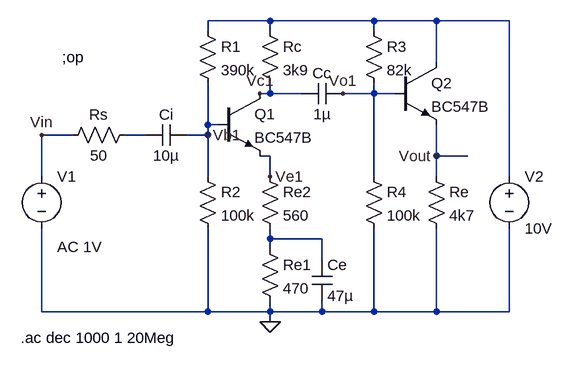
[diagram p0: schematic Combined.asc]
Combined.asc, the LTspice schematic file:
Version 4
SHEET 1 1304 680
WIRE 496 -288 400 -288
WIRE 656 -288 496 -288
WIRE 752 -288 656 -288
WIRE 864 -288 752 -288
WIRE 400 -272 400 -288
WIRE 496 -272 496 -288
WIRE 656 -272 656 -288
WIRE 752 -224 752 -288
WIRE 496 -176 496 -192
WIRE 496 -176 480 -176
WIRE 528 -176 496 -176
WIRE 544 -176 528 -176
WIRE 656 -176 656 -192
WIRE 656 -176 608 -176
WIRE 672 -176 656 -176
WIRE 688 -176 672 -176
WIRE 400 -128 400 -192
WIRE 416 -128 400 -128
WIRE 192 -112 144 -112
WIRE 304 -112 272 -112
WIRE 400 -112 400 -128
WIRE 400 -112 368 -112
WIRE 496 -80 480 -80
WIRE 752 -80 752 -128
WIRE 784 -80 752 -80
WIRE 800 -80 784 -80
WIRE 144 -48 144 -112
WIRE 400 -48 400 -112
WIRE 496 -48 496 -80
WIRE 656 -48 656 -176
WIRE 752 -48 752 -80
WIRE 864 -48 864 -288
WIRE 496 48 496 32
WIRE 576 48 496 48
WIRE 496 64 496 48
WIRE 576 80 576 48
WIRE 144 160 144 32
WIRE 400 160 400 32
WIRE 400 160 144 160
WIRE 496 160 496 144
WIRE 496 160 400 160
WIRE 576 160 576 144
WIRE 576 160 496 160
WIRE 656 160 656 32
WIRE 656 160 576 160
WIRE 752 160 752 32
WIRE 752 160 656 160
WIRE 864 160 864 32
WIRE 864 160 752 160
WIRE 496 176 496 160
FLAG 496 176 0
FLAG 144 -112 Vin
FLAG 752 -80 Vout
FLAG 608 -176 Vo1
FLAG 400 -112 Vb1
FLAG 496 -48 Ve1
FLAG 480 -176 Vc1
DATAFLAG 784 -80 ""
DATAFLAG 368 -112 ""
DATAFLAG 672 -176 ""
DATAFLAG 496 -80 ""
DATAFLAG 528 -176 ""
SYMBOL voltage 144 -64 R0
WINDOW 3 24 152 Left 2
WINDOW 123 24 124 Left 2
WINDOW 39 0 0 Left 2
SYMATTR Value ""
SYMATTR Value2 AC 1V
SYMATTR InstName V1
SYMBOL res 288 -128 R90
WINDOW 0 0 56 VBottom 2
WINDOW 3 32 56 VTop 2
SYMATTR InstName Rs
SYMATTR Value 50
SYMBOL cap 368 -128 R90
WINDOW 0 0 32 VBottom 2
WINDOW 3 32 32 VTop 2
SYMATTR InstName Ci
SYMATTR Value 10µ
SYMBOL res 384 -64 R0
SYMATTR InstName R2
SYMATTR Value 100k
SYMBOL res 384 -288 R0
SYMATTR InstName R1
SYMATTR Value 390k
SYMBOL npn 416 -176 R0
SYMATTR InstName Q1
SYMATTR Value BC547B
SYMBOL res 480 -64 R0
SYMATTR InstName Re2
SYMATTR Value 560
SYMBOL res 480 48 R0
SYMATTR InstName Re1
SYMATTR Value 470
SYMBOL cap 560 80 R0
SYMATTR InstName Ce
SYMATTR Value 47µ
SYMBOL res 480 -288 R0
SYMATTR InstName Rc
SYMATTR Value 3k9
SYMBOL cap 608 -192 R90
WINDOW 0 0 32 VBottom 2
WINDOW 3 32 32 VTop 2
SYMATTR InstName Cc
SYMATTR Value 1µ
SYMBOL res 640 -288 R0
SYMATTR InstName R3
SYMATTR Value 82k
SYMBOL res 640 -64 R0
SYMATTR InstName R4
SYMATTR Value 100k
SYMBOL npn 688 -224 R0
SYMATTR InstName Q2
SYMATTR Value BC547B
SYMBOL res 736 -64 R0
SYMATTR InstName Re
SYMATTR Value 4k7
SYMBOL voltage 864 -64 R0
WINDOW 123 0 0 Left 2
WINDOW 39 0 0 Left 2
SYMATTR InstName V2
SYMATTR Value 10V
TEXT 112 200 Left 2 !.ac dec 1000 1 20Meg
TEXT 176 -232 Left 2 !;op

The netlist it stands for:
* Combined.asc
V1 Vin 0 AC 1V
Rs N002 Vin 50
Ci Vb1 N002 10µ
R2 Vb1 0 100k
R1 N001 Vb1 390k
Q1 Vc1 Vb1 Ve1 0 BC547B
Re2 Ve1 N003 560
Re1 N003 0 470
Ce N003 0 47µ
Rc N001 Vc1 3k9
Cc Vo1 Vc1 1µ
R3 N001 Vo1 82k
R4 Vo1 0 100k
Q2 N001 Vo1 Vout 0 BC547B
Re Vout 0 4k7
V2 N001 0 10V
.model NPN NPN
.model PNP PNP
.lib standard.bjt
.ac dec 1000 1 20Meg
;op
.backanno
.end